# EAGLE design iigs (EAGLE 9.6.2)
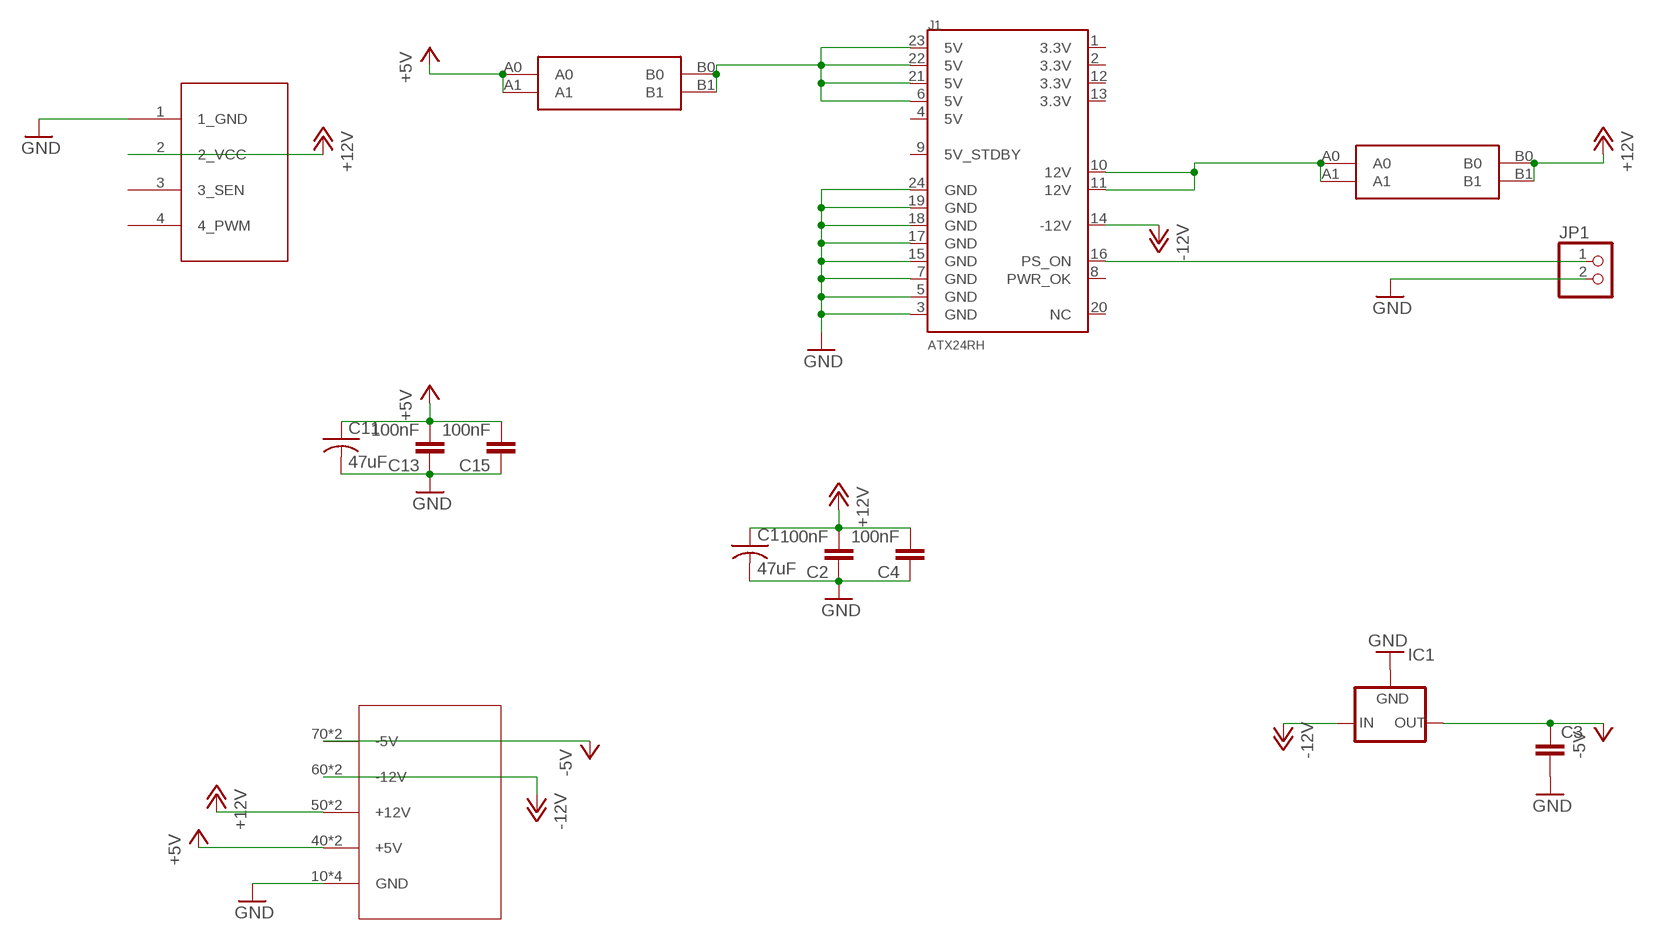
[diagram p0: schematic, sheet 1]

## Parts
C1  47uF  C-USC1210  [C1210]
C2  100nF  CAP0805  [0805@1]
C3  C5/2.5  [C5B2.5]
C4  100nF  CAP0805  [0805@1]
C11  47uF  C-USC1210  [C1210]
C13  100nF  CAP0805  [0805@1]
C15  100nF  CAP0805  [0805@1]
IC1  79XXS  [79XXS]
J1  ATX24RH  [ATX24_RIGHT_ANGLE]
JP1  PINHD-1X2  [1X02]
JP4  4PIN_FAN  [1X04]
U$1  CAR_FUSE_HOLDER3IN1  [FUSE_HOLDER_3IN1]
U$2  CAR_FUSE_HOLDER3IN1  [FUSE_HOLDER_3IN1]
U$7  3.96_FEM_IIGS  [3.96_FEMALE_IIGS_GAP]

## Nets
+5V: C11.1 C13.2 C15.2 U$1.A0 U$1.A1 U$7.40(+5V) U$7.41(+5V)
+12V: C1.1 C2.2 C4.2 JP4.2(2_VCC) U$2.B0 U$2.B1 U$7.50(+12V) U$7.51(+12V)
-5V: C3.1 IC1.OUT U$7.70(-5V) U$7.71(-5V)
-12V: IC1.IN J1.14(-12V) U$7.60(-12V) U$7.61(-12V)
GND: C1.2 C2.1 C3.2 C4.1 C11.2 C13.1 C15.1 IC1.GND J1.3(GND) J1.5(GND) J1.7(GND) J1.15(GND) J1.17(GND) J1.18(GND) J1.19(GND) J1.24(GND) JP1.2 JP4.1(1_GND) U$7.10(GND) U$7.11(GND) U$7.20(GND) U$7.21(GND)
N$5: J1.16(PS_ON) JP1.1
N$6: J1.6(5V) J1.21(5V) J1.22(5V) J1.23(5V) U$1.B0 U$1.B1
N$8: J1.10(12V) J1.11(12V) U$2.A0 U$2.A1
Unconnected: J1.1(3.3V) J1.2(3.3V) J1.4(5V) J1.8(PWR_OK) J1.9(5V_STDBY) J1.12(3.3V) J1.13(3.3V) J1.20(NC) JP4.3(3_SEN) JP4.4(4_PWM)

## Library data of the parts
C1 C11 = clock:C-US: CAPACITOR, American symbol
C2 C4 C13 C15 = clock:CAP: Capacitor Standard 0603 ceramic capacitor, and 0.1" leaded capacitor.
C3 = capacitor-wima:C: CAPACITOR naming: grid - package width
IC1 = v-reg:79XXS: VOLTAGE REGULATOR
J1 = appleii:ATX24: ATX24 Pin Power Supply Connector This is a good connector for connecting a computer power supply to a PCB. It's massive, but provides many amps of power at 5V and 12V. SKU: PRT-09498
JP1 = pinhead:PINHD-1X2: PIN HEADER
JP4 = appleii:4PIN_FAN: PIN HEADER
U$1 U$2 = atx_power_control:CAR_FUSE_HOLDER
U$7 = atx4vc:3.96_FEM_IIGS

## Board
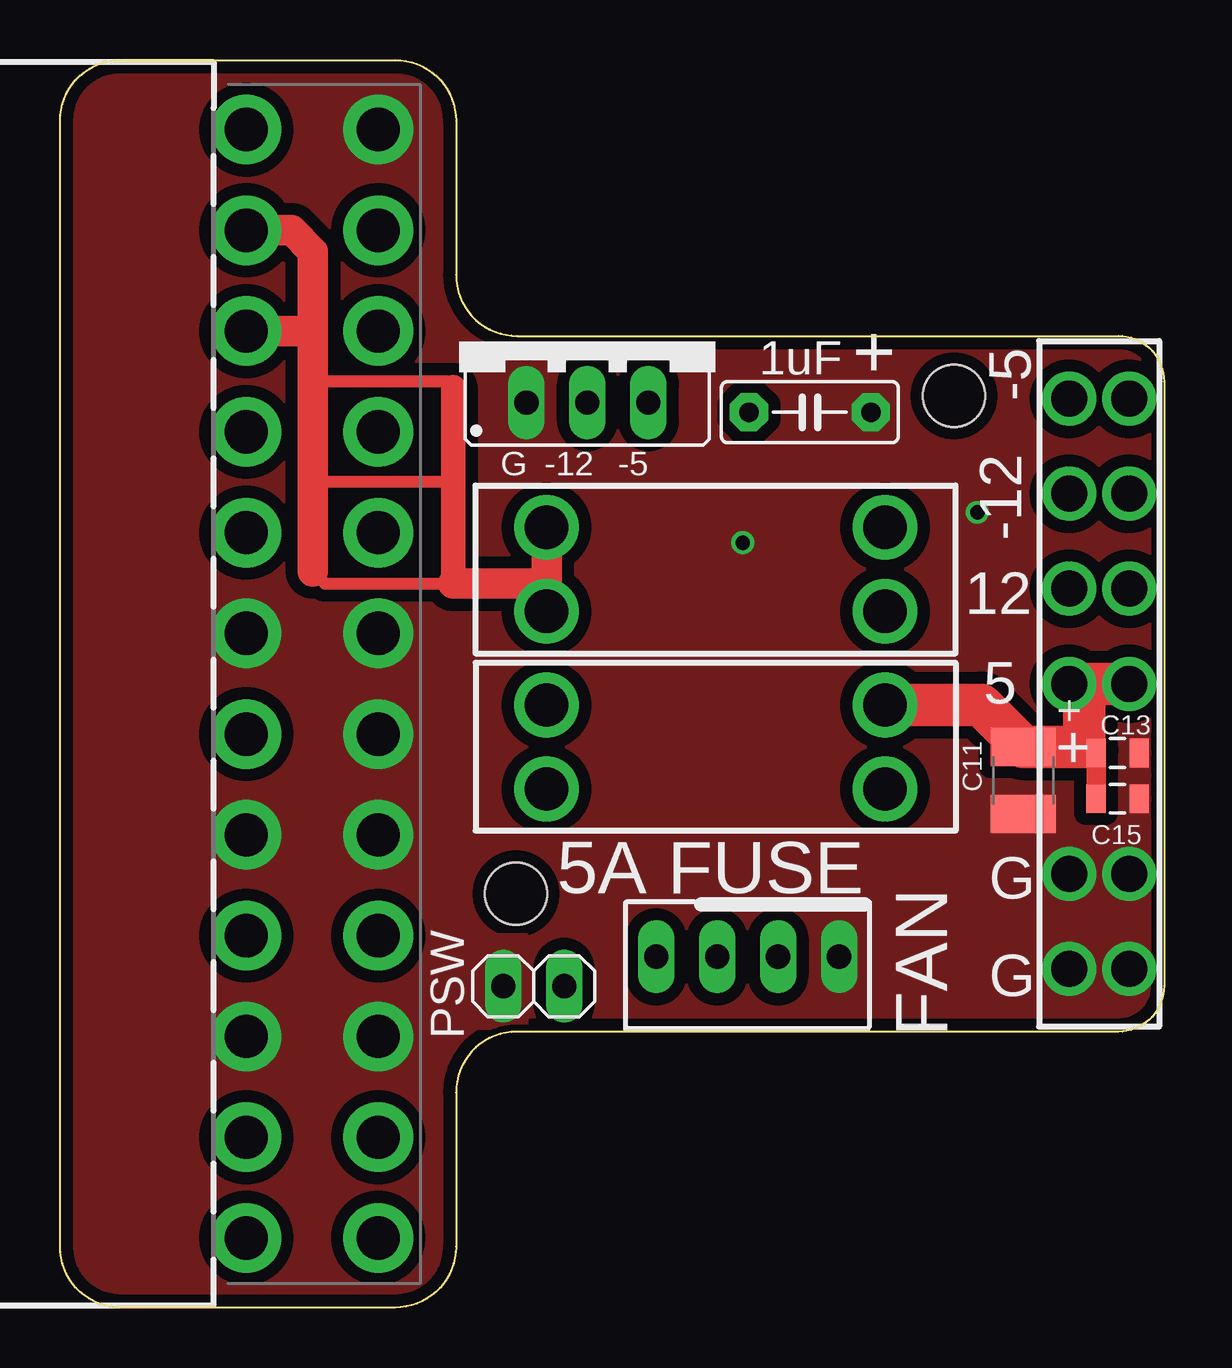
[diagram p1: board, top side]
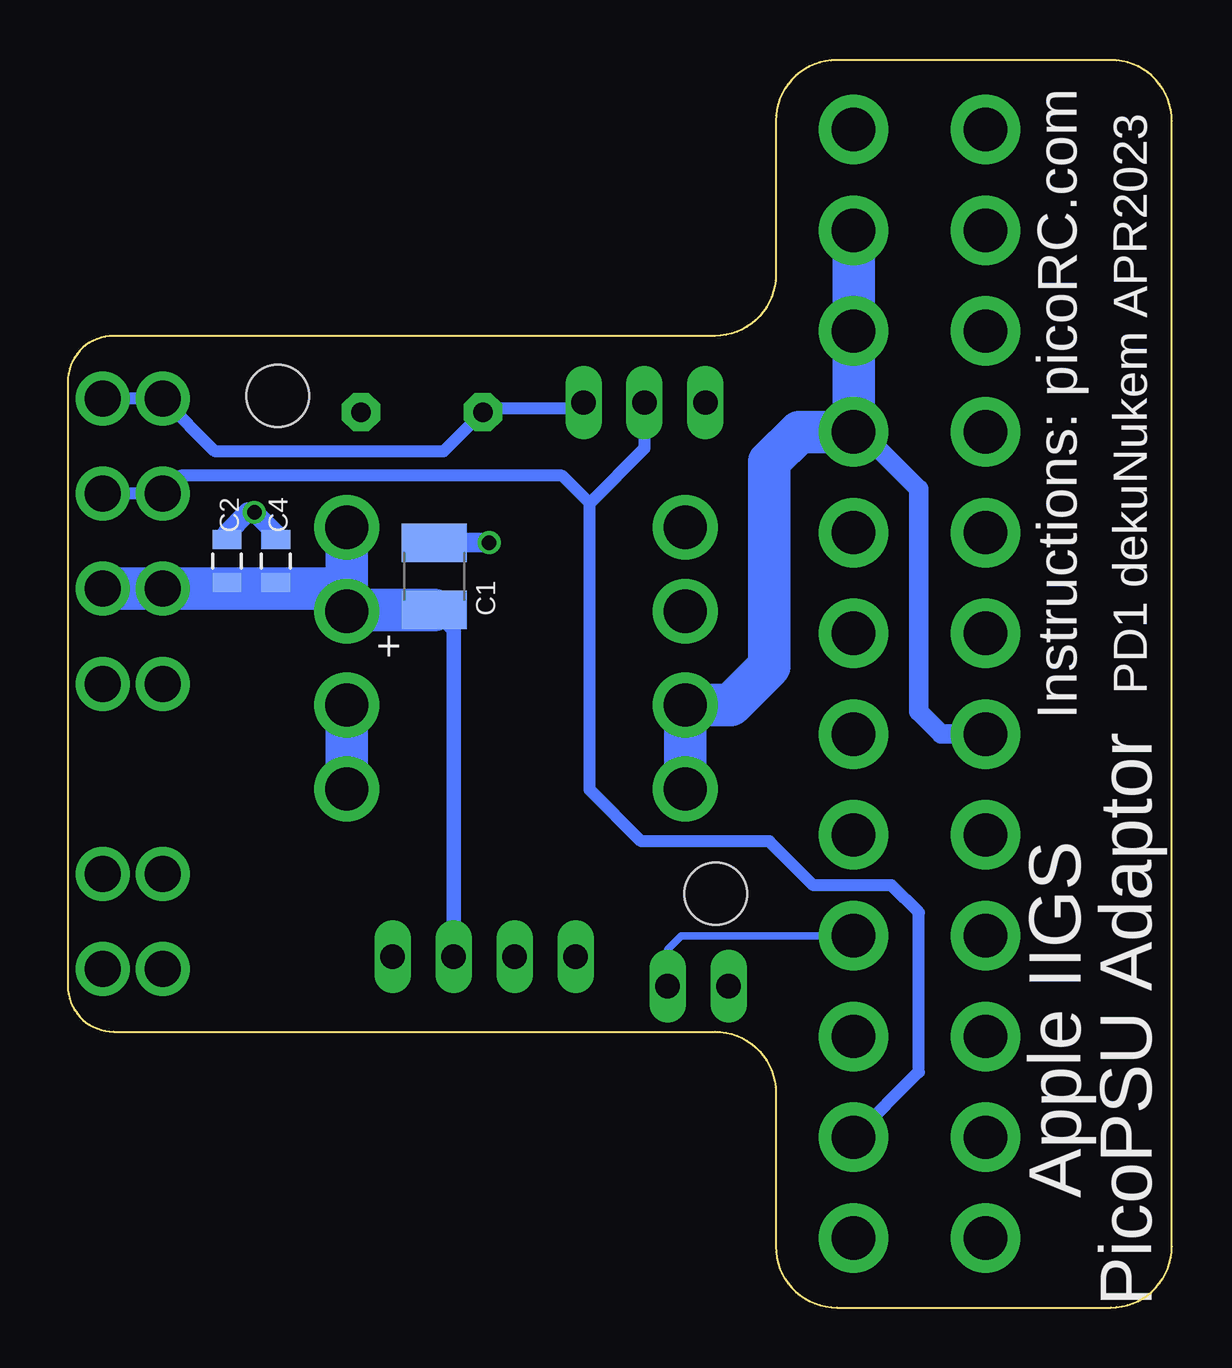
[diagram p2: board, bottom side, seen from below]

Size 46 x 52 mm. Coordinates in mm from the lower left corner, seen from the top.
Outline: 44.09,11.5 19.04,11.5 arc90 16.5,8.96 16.5,2.54 arc-90 13.96,0 2.54,0 arc-90 0,2.54 0,49.46 arc-90 2.54,52 13.96,52 arc-90 16.5,49.46 16.5,43.04 arc90 19.04,40.5 44.09,40.5 arc-90 46,38.59 46,13.4 arc-90 44.09,11.5
Copper layers (1*16): Top 0.035mm / dielectric 1.5mm / Bottom 0.035mm
Design rules "deku_2layer_6mil *": minimum track width 6mil, minimum drill 15mil, track to track 12mil, track to pad 12mil, pad to pad 12mil, via to via 12mil, smd to smd 6mil, copper to edge 10mil, drill to drill 6mil, minimum pad ring 7mil, minimum via ring 7mil, stop-mask expansion 4mil, vias tented up to drill 25mil, thermal gap 10mil
Holes 2.6 mm at 19,17.25 37.25,38

### Footprints (pad centres in the part's own frame; a part is rotated, then mirrored left to right if it is on the bottom)
C1210 = smd 1.6 x 2.7: 1 -1.4,0; 2 1.4,0
0805@1 = smd 0.8 x 1.2: 1 -0.9,0; 2 0.9,0
C5B2.5 = drill 0.813 pad 1.6 octagon: 1 -2.54,0; 2 2.54,0
79XXS = drill 1.016 long: GND -2.54,-2.54; IN 0,-2.54; OUT 2.54,-2.54
ATX24_RIGHT_ANGLE = drill 1.8 pad 2.9: 1 23.1,4.76; 2 18.9,4.76; 3 14.7,4.76; 4 10.5,4.76; 5 6.3,4.76; 6 2.1,4.76; 7 -2.1,4.76; 8 -6.3,4.76; 9 -10.5,4.76; 10 -14.7,4.76; 11 -18.9,4.76; 12 -23.1,4.76; 13 23.1,10.26; 14 18.9,10.26; 15 14.7,10.26; 16 10.5,10.26; 17 6.3,10.26; 18 2.1,10.26; 19 -2.1,10.26; 20 -6.3,10.26; 21 -10.5,10.26; 22 -14.7,10.26; 23 -18.9,10.26; 24 -23.1,10.26
1X02 = drill 1.016 long: 1 -1.27,0; 2 1.27,0
1X04 = drill 1.016 long: 1 -3.81,0; 2 -1.27,0; 3 1.27,0; 4 3.81,0
FUSE_HOLDER_3IN1 = drill 1.8: A0 -7.05,1.75; A1 -7.05,-1.75; B0 7.05,1.75; B1 7.05,-1.75
3.96_FEMALE_IIGS_GAP = drill 1.5: 10 11.88,-1.25; 11 11.88,1.25; 20 7.92,-1.25; 21 7.92,1.25; 40 0,-1.25; 41 0,1.25; 50 -3.96,-1.25; 51 -3.96,1.25; 60 -7.92,-1.25; 61 -7.92,1.25; 70 -11.88,-1.25; 71 -11.88,1.25

### Placement (x,y rotation side)
C1  30.73,30.48 90 bottom
C2  39.37,31.11 270 bottom
C3  31.24,37.32 0 top
C4  37.34,31.11 270 bottom
C11  40.13,21.97 270 top
C13  44.07,23.11 180 top
C15  44.07,21.21 180 top
IC1  21.97,40.26 0 top
J1  3,26 270 top
JP1  19.74,13.39 180 top
JP4  28.65,14.62 180 top
U$1  27.32,23.37 180 top
U$2  27.32,30.77 0 top
U$7  43.3,26 270 top

### Tracks (layer width: path | path; a pad name or v marks a point on that pad's centre or on a via)
+5V
  Top 0.813: C15.2 C13.2 43.17,23.37 C11.1
  Top 1.778: U$1.A1 38.38,25.12 C11.1 42.67,23.37 42.67,26 U$7.40 | 42.03,25.98 U$7.40 | U$7.40 U$7.41
  Bottom 1.778: U$1.A1 U$1.A0
+12V
  Bottom 0.61: U$2.B1 33.72,29.02 | C1.1 29.92,28.27 JP4.2 | C4.2 C2.2 41.79,30.21 U$7.50
  Bottom 1.778: U$2.B0 U$2.B1 | U$2.B1 34.37,29.96 | U$7.51 U$7.50 35.31,29.96 U$2.B1 | C1.1 34.31,29.08 U$2.B1
-5V
  Bottom 0.508: U$7.71 U$7.70 39.85,35.69 30.35,35.69 28.72,37.32 C3.1 28.56,37.47 24.77,37.47 IC1.OUT
-12V
  Bottom 0.508: J1.14 10.54,9.82 10.54,16.46 11.68,17.6 14.94,17.6 16.76,19.43 22.1,19.43 24.26,21.59 24.26,33.53 | 24.26,33.53 25.4,34.67 41.3,34.67 U$7.60 U$7.61 | IC1.IN 21.97,35.81 24.26,33.53
GND  (via drill 0.6)
  Bottom 0.813: v28.45,31.88 C1.2 | C4.1 37.34,32.26 v38.23,33.15 38.49,33.15 39.37,32.27 C2.1
  pour Top (isolate 0.508): 59.92,52.32 0,52.32 0,0.02 59.92,0.02
  pour Top (no thermals): 17.4,15.49 17.4,11.68 19.43,11.68 19.43,15.49 17.53,15.49
  pour Top (no thermals): 32.26,38.61 35.31,38.61 35.31,36.07 32.26,36.07
  pour Top (no thermals): 18.41,39.37 20.45,39.37 20.45,35.56 18.41,35.56
  pour Top (no thermals): 44.32,24 45.34,24 45.34,20.32 44.32,20.32
  pour Top (no thermals): 38.48,19.3 38.48,21.59 41.66,21.59 41.66,19.3
N$5
  Bottom 0.305: J1.16 20.44,15.5 21.01,14.93 JP1.1
N$6
  Bottom 0.813: J1.6 9.6,23.9 10.54,24.84 10.54,34.11 12.93,36.5 J1.21
  Bottom 1.778: J1.23 J1.22 J1.21 15.52,36.5 16.76,35.26 16.76,26.72 18.37,25.12 U$1.B1 U$1.B0
N$8
  Top 0.508: 10.62,38.61 16.13,38.61 16.38,38.36 | 16.38,30.18 11.05,30.18 10.54,30.68 | 10.54,34.49 10.62,34.42 16.38,34.42
  Top 0.61: 10.62,38.61 10.54,38.69
  Top 0.813: 10.52,40.7 10.54,40.72
  Top 1.016: 16.38,38.36 16.38,34.42 16.38,30.18
  Top 1.27: J1.11 9.66,44.9 10.54,44.02 10.54,40.72 10.54,38.69 10.54,34.49 10.54,30.68 | J1.10 10.52,40.7 | 16.38,30.18 20.27,30.18 | 20.27,30.18 U$2.A0 | U$2.A1 20.27,30.18

### Text on the board
tNames: 1uF | + | -5 | G | -12 | -5 | -12 | 12 | 5 | + | 5A FUSE | G | FAN | G | PSW
bNames: PD1 dekuNukem APR2023 | Instructions: picoRC.com | Apple IIGS / PicoPSU Adaptor